# EAGLE design SparkFun_Adapter-SSOP20-v10 (EAGLE 7.2.0)
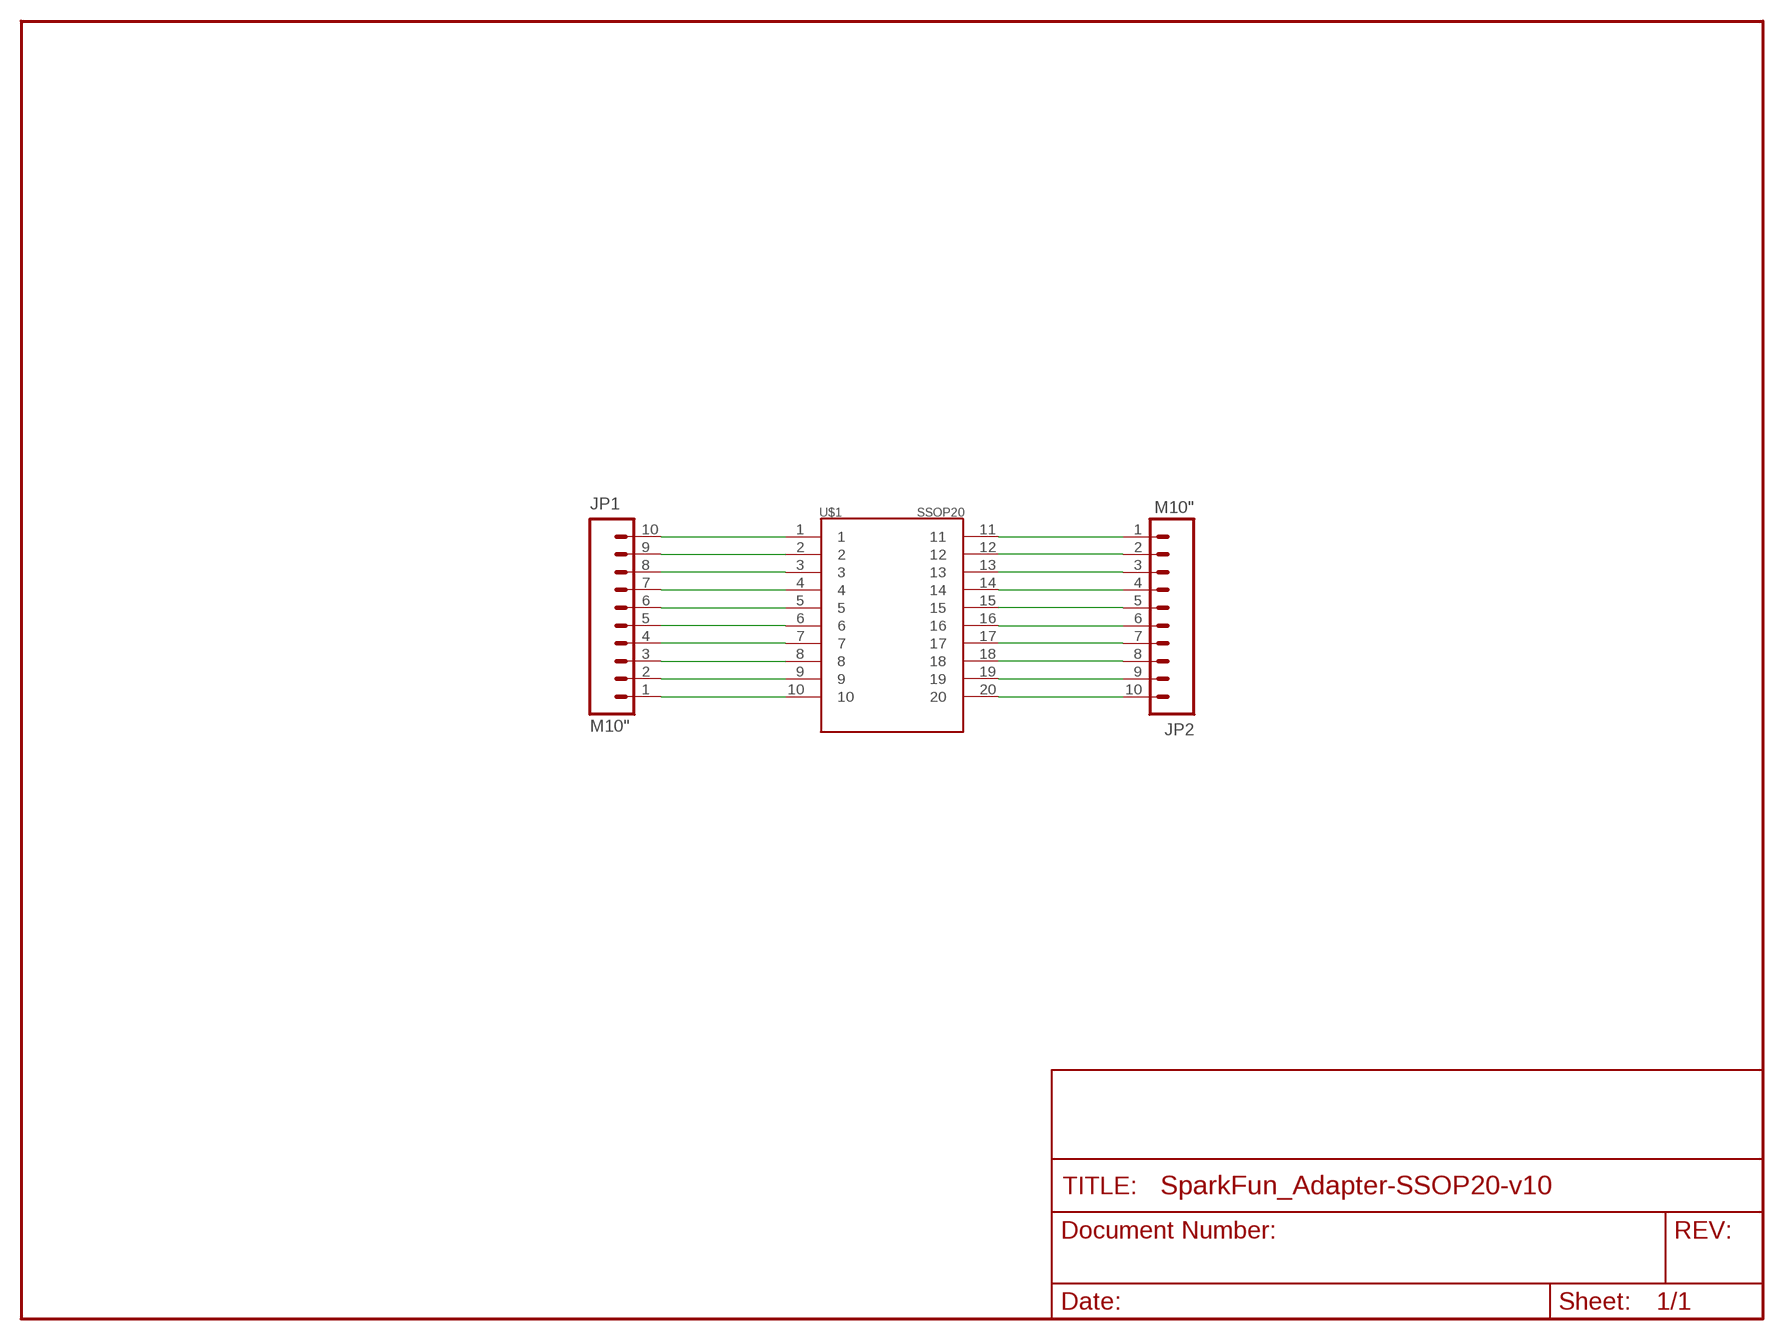
[diagram p0: schematic, sheet 1]

## Parts
JP1  M10"  [1X10]
JP2  M10"  [1X10]
U$1  SSOP20  [SSOP20-LONG]

## Nets
N$1: JP1.10 U$1.1
N$2: JP1.9 U$1.2
N$4: JP1.7 U$1.4
N$5: JP1.6 U$1.5
N$8: JP1.3 U$1.8
N$9: JP1.2 U$1.9
N$10: JP1.1 U$1.10
N$13: JP1.8 U$1.3
N$16: JP1.5 U$1.6
N$17: JP1.4 U$1.7
N$21: JP2.1 U$1.11
N$24: JP2.4 U$1.14
N$26: JP2.6 U$1.16
N$29: JP2.9 U$1.19
N$30: JP2.10 U$1.20
N$32: JP2.2 U$1.12
N$33: JP2.3 U$1.13
N$35: JP2.5 U$1.15
N$37: JP2.7 U$1.17
N$38: JP2.8 U$1.18

## Library data of the parts
JP1 JP2 = SparkFun:M10: Header 10 Standard 10-pin 0.1" header. Use with straight break away headers (SKU : PRT-00116), right angle break away headers (PRT-00553), swiss pins (PRT-00743), machine pins (PRT-00117), and female headers (PRT-00115).
U$1 = SparkFun:SSOP20

## Board
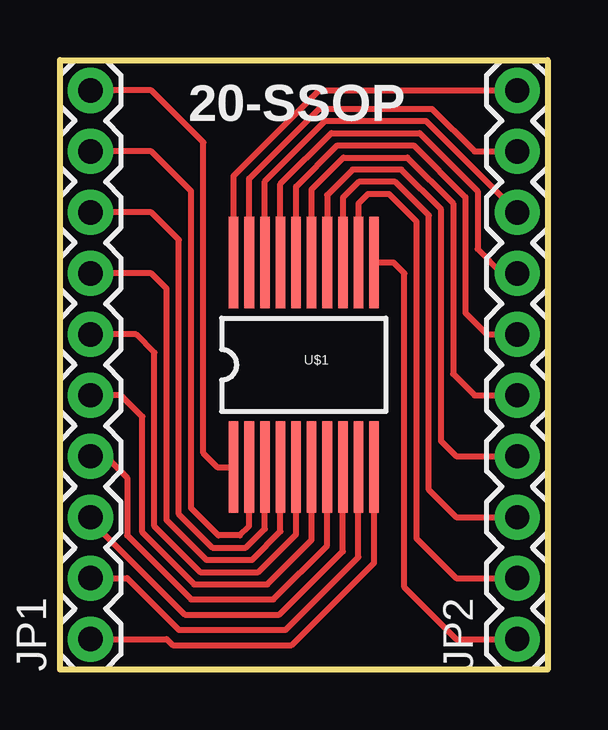
[diagram p1: board, top side]
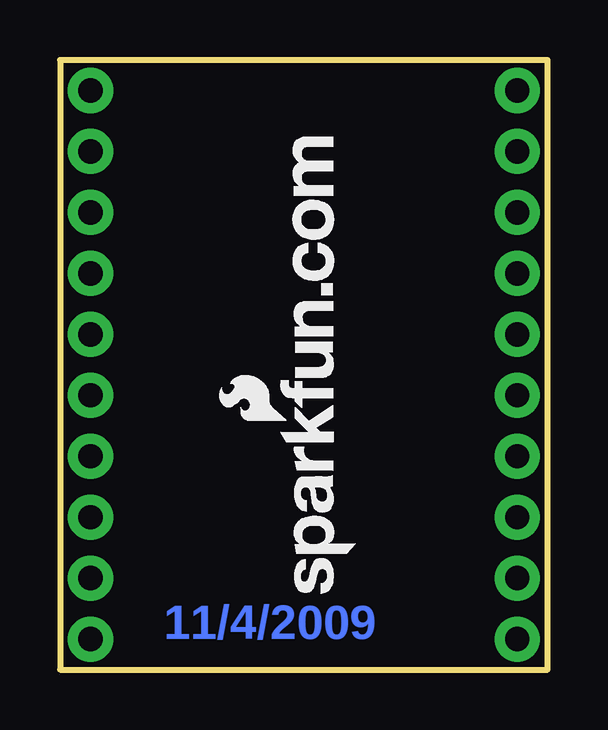
[diagram p2: board, bottom side, seen from below]

Size 20.32 x 25.4 mm. Coordinates in mm from the lower left corner, seen from the top.
Outline: 0,0 0,25.4 20.32,25.4 20.32,0 0,0
Copper layers (1*16): Top 0.035mm / dielectric 1.5mm / Bottom 0.035mm
Design rules "SparkFun": minimum track width 8mil, minimum drill 20mil, track to track 8mil, track to pad 8mil, pad to pad 8mil, via to via 8mil, smd to smd 8mil, copper to edge 9mil, drill to drill 8mil, minimum pad ring 12mil, minimum via ring 10mil, stop-mask expansion 4mil, vias tented up to drill 20mil, thermal gap 10mil

### Footprints (pad centres in the part's own frame; a part is rotated, then mirrored left to right if it is on the bottom)
1X10 = drill 1.016 pad 1.88: 1 0,0; 2 2.54,0; 3 5.08,0; 4 7.62,0; 5 10.16,0; 6 12.7,0; 7 15.24,0; 8 17.78,0; 9 20.32,0; 10 22.86,0
SSOP20-LONG = smd 0.4 x 3.81: 1 -2.925,-4.26; 2 -2.275,-4.26; 3 -1.625,-4.26; 4 -0.975,-4.26; 5 -0.325,-4.26; 6 0.325,-4.26; 7 0.975,-4.26; 8 1.625,-4.26; 9 2.275,-4.26; 10 2.925,-4.26; 11 2.925,4.26; 12 2.275,4.26; 13 1.625,4.26; 14 0.975,4.26; 15 0.325,4.26; 16 -0.325,4.26; 17 -0.975,4.26; 18 -1.625,4.26; 19 -2.275,4.26; 20 -2.925,4.26

### Placement (x,y rotation side)
JP1  1.27,1.27 90 top
JP2  19.05,1.27 90 top
JP3  LOGO-SFENEW  [SFE-NEW-WEBLOGO]  8,3.17 90 bottom
U$1  10.16,12.7 0 top

### Tracks (layer width: path | path; a pad name or v marks a point on that pad's centre or on a via)
N$1
  Top 0.254: U$1.1 6.55,8.44 5.97,9.02 5.97,21.97 3.81,24.13 JP1.10
N$2
  Top 0.254: U$1.2 7.88,5.98 7.49,5.59 6.6,5.59 5.46,6.73 5.46,19.94 3.81,21.59 JP1.9
N$4
  Top 0.254: U$1.4 9.19,5.76 8,4.57 6.1,4.57 4.45,6.22 4.45,15.88 3.81,16.51 JP1.7
N$5
  Top 0.254: U$1.5 9.84,5.64 8.26,4.06 5.84,4.06 3.94,5.97 3.94,13.21 3.17,13.97 JP1.6
N$8
  Top 0.254: U$1.8 11.79,4.93 9.14,2.29 5.21,2.29 1.14,6.35 JP1.3
N$9
  Top 0.254: U$1.9 12.44,4.69 9.4,1.65 4.95,1.65 2.79,3.81 JP1.2
N$10
  Top 0.254: U$1.10 13.09,4.45 9.65,1.02 4.7,1.02 4.45,1.27 JP1.1
N$13
  Top 0.254: JP1.8 3.81,19.05 4.95,17.91 4.95,6.48 6.35,5.08 7.75,5.08 8.54,5.87 U$1.3
N$16
  Top 0.254: U$1.6 10.48,5.41 8.64,3.56 5.59,3.56 3.43,5.71 3.43,10.54 2.54,11.43 JP1.5
N$17
  Top 0.254: U$1.7 11.13,5.17 8.89,2.92 5.46,2.92 2.79,5.59 2.79,8 1.91,8.89 JP1.4
N$21
  Top 0.254: U$1.11 13.9,16.96 14.35,16.51 14.35,3.43 16.51,1.27 JP2.1
N$24
  Top 0.254: U$1.14 11.13,19.77 12.19,20.83 14.22,20.83 15.88,19.18 15.88,9.53 16.51,8.89 JP2.4
N$26
  Top 0.254: U$1.16 9.84,20.12 11.56,21.84 14.73,21.84 16.89,19.68 16.89,14.86 17.78,13.97 JP2.6
N$29
  Top 0.254: U$1.19 7.88,20.46 10.79,23.37 15.49,23.37 17.27,21.59 JP2.9
N$30
  Top 0.254: U$1.20 7.24,20.57 10.79,24.13 JP2.10
N$32
  Top 0.254: U$1.12 12.44,19.42 12.83,19.81 13.72,19.81 14.86,18.67 14.86,5.46 16.51,3.81 JP2.2
N$33
  Top 0.254: U$1.13 11.79,19.66 12.45,20.32 13.97,20.32 15.37,18.92 15.37,7.49 16.51,6.35 JP2.3
N$35
  Top 0.254: U$1.15 10.48,20.01 11.81,21.34 14.48,21.34 16.38,19.43 16.38,12.32 17.27,11.43 JP2.5
N$37
  Top 0.254: U$1.17 9.19,20.23 11.3,22.35 14.99,22.35 17.4,19.94 17.4,17.53 18.41,16.51 JP2.7
N$38
  Top 0.254: U$1.18 8.54,20.35 11.05,22.86 15.24,22.86 JP2.8

### Text on the board
Bottom: 11/4/2009
tPlace: 20-SSOP